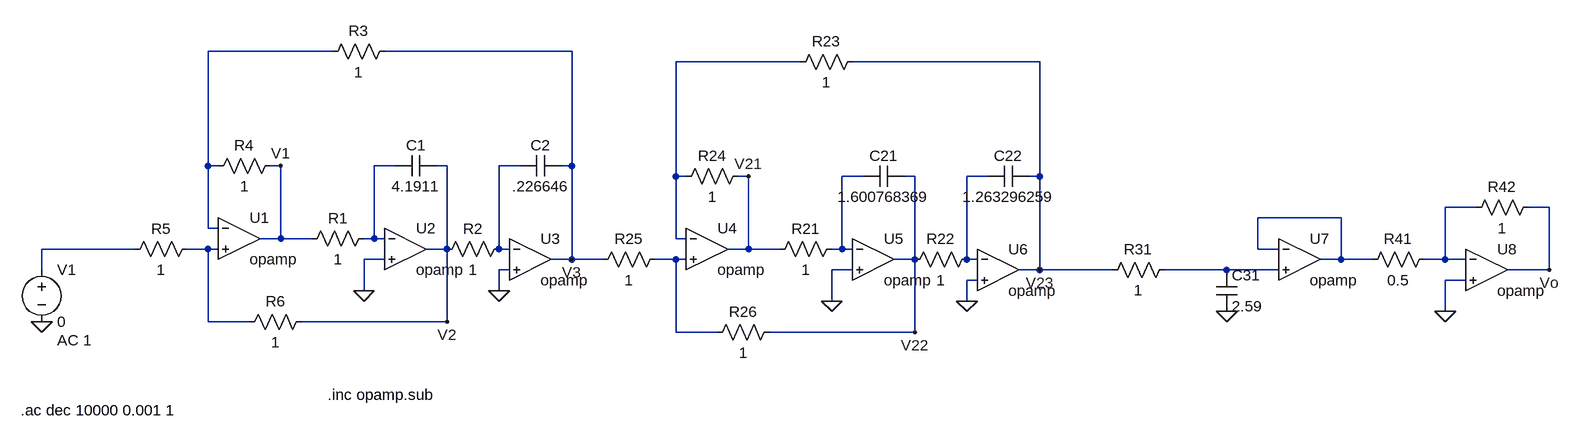
[diagram p0: schematic TS4.asc]
TS4.asc, the LTspice schematic file:
Version 4
SHEET 1 2228 680
WIRE 320 -144 128 -144
WIRE 688 -144 400 -144
WIRE 1040 -128 848 -128
WIRE 1408 -128 1120 -128
WIRE 128 32 128 -144
WIRE 144 32 128 32
WIRE 240 32 224 32
WIRE 416 32 384 32
WIRE 496 32 480 32
WIRE 608 32 576 32
WIRE 688 32 688 -144
WIRE 688 32 672 32
WIRE 848 48 848 -128
WIRE 864 48 848 48
WIRE 960 48 944 48
WIRE 1136 48 1104 48
WIRE 1216 48 1200 48
WIRE 1328 48 1296 48
WIRE 1408 48 1408 -128
WIRE 1408 48 1392 48
WIRE 2080 96 2032 96
WIRE 2192 96 2160 96
WIRE 1872 112 1744 112
WIRE 128 128 128 32
WIRE 144 128 128 128
WIRE 240 144 240 32
WIRE 240 144 208 144
WIRE 288 144 240 144
WIRE 384 144 384 32
WIRE 384 144 368 144
WIRE 400 144 384 144
WIRE 848 144 848 48
WIRE 864 144 848 144
WIRE 16 160 -128 160
WIRE 128 160 96 160
WIRE 144 160 128 160
WIRE 496 160 496 32
WIRE 496 160 464 160
WIRE 576 160 576 32
WIRE 592 160 576 160
WIRE 960 160 960 48
WIRE 960 160 928 160
WIRE 1008 160 960 160
WIRE 1104 160 1104 48
WIRE 1104 160 1088 160
WIRE 1120 160 1104 160
WIRE 1744 160 1744 112
WIRE 1776 160 1744 160
WIRE 400 176 368 176
WIRE 688 176 688 32
WIRE 688 176 656 176
WIRE 736 176 688 176
WIRE 848 176 816 176
WIRE 864 176 848 176
WIRE 1216 176 1216 48
WIRE 1216 176 1184 176
WIRE 1296 176 1296 48
WIRE 1312 176 1296 176
WIRE 1872 176 1872 112
WIRE 1872 176 1840 176
WIRE 1920 176 1872 176
WIRE 2032 176 2032 96
WIRE 2032 176 2000 176
WIRE 2064 176 2032 176
WIRE -128 192 -128 160
WIRE 592 192 576 192
WIRE 1120 192 1088 192
WIRE 1408 192 1408 48
WIRE 1408 192 1376 192
WIRE 1520 192 1408 192
WIRE 1696 192 1600 192
WIRE 1776 192 1696 192
WIRE 2192 192 2192 96
WIRE 2192 192 2128 192
WIRE 1312 208 1296 208
WIRE 2064 208 2032 208
WIRE 368 224 368 176
WIRE 576 224 576 192
WIRE 1088 240 1088 192
WIRE 1296 240 1296 208
WIRE 2032 256 2032 208
WIRE 128 272 128 160
WIRE 192 272 128 272
WIRE 496 272 496 160
WIRE 496 272 272 272
WIRE 848 288 848 176
WIRE 912 288 848 288
WIRE 1216 288 1216 176
WIRE 1216 288 992 288
FLAG 496 272 V2
FLAG 240 32 V1
FLAG 688 176 V3
FLAG 576 224 0
FLAG 368 224 0
FLAG -128 272 0
FLAG 1216 288 V22
FLAG 960 48 V21
FLAG 1408 192 V23
FLAG 1296 240 0
FLAG 1088 240 0
FLAG 1696 256 0
FLAG 2032 256 0
FLAG 2192 192 Vo
SYMBOL res 112 144 R90
WINDOW 0 0 56 VBottom 2
WINDOW 3 32 56 VTop 2
SYMATTR InstName R5
SYMATTR Value 1
SYMBOL Opamps\\opamp 176 80 R0
SYMATTR InstName U1
SYMBOL res 240 16 R90
WINDOW 0 0 56 VBottom 2
WINDOW 3 32 56 VTop 2
SYMATTR InstName R4
SYMATTR Value 1
SYMBOL res 288 256 R90
WINDOW 0 0 56 VBottom 2
WINDOW 3 32 56 VTop 2
SYMATTR InstName R6
SYMATTR Value 1
SYMBOL res 384 128 R90
WINDOW 0 0 56 VBottom 2
WINDOW 3 32 56 VTop 2
SYMATTR InstName R1
SYMATTR Value 1
SYMBOL Opamps\\opamp 432 96 R0
SYMATTR InstName U2
SYMBOL cap 480 16 R90
WINDOW 0 0 32 VBottom 2
WINDOW 3 32 32 VTop 2
SYMATTR InstName C1
SYMATTR Value 4.1911
SYMBOL Opamps\\opamp 624 112 R0
SYMATTR InstName U3
SYMBOL res 592 144 R90
WINDOW 0 0 56 VBottom 2
WINDOW 3 32 56 VTop 2
SYMATTR InstName R2
SYMATTR Value 1
SYMBOL cap 672 16 R90
WINDOW 0 0 32 VBottom 2
WINDOW 3 32 32 VTop 2
SYMATTR InstName C2
SYMATTR Value .226646
SYMBOL voltage -128 176 R0
WINDOW 123 24 124 Left 2
WINDOW 39 0 0 Left 2
SYMATTR Value2 AC 1
SYMATTR InstName V1
SYMATTR Value 0
SYMBOL res 416 -160 R90
WINDOW 0 0 56 VBottom 2
WINDOW 3 32 56 VTop 2
SYMATTR InstName R3
SYMATTR Value 1
SYMBOL res 832 160 R90
WINDOW 0 0 56 VBottom 2
WINDOW 3 32 56 VTop 2
SYMATTR InstName R25
SYMATTR Value 1
SYMBOL Opamps\\opamp 896 96 R0
SYMATTR InstName U4
SYMBOL res 960 32 R90
WINDOW 0 0 56 VBottom 2
WINDOW 3 32 56 VTop 2
SYMATTR InstName R24
SYMATTR Value 1
SYMBOL res 1008 272 R90
WINDOW 0 0 56 VBottom 2
WINDOW 3 32 56 VTop 2
SYMATTR InstName R26
SYMATTR Value 1
SYMBOL res 1104 144 R90
WINDOW 0 0 56 VBottom 2
WINDOW 3 32 56 VTop 2
SYMATTR InstName R21
SYMATTR Value 1
SYMBOL Opamps\\opamp 1152 112 R0
SYMATTR InstName U5
SYMBOL cap 1200 32 R90
WINDOW 0 0 32 VBottom 2
WINDOW 3 32 32 VTop 2
SYMATTR InstName C21
SYMATTR Value 1.600768369
SYMBOL Opamps\\opamp 1344 128 R0
SYMATTR InstName U6
SYMBOL res 1312 160 R90
WINDOW 0 0 56 VBottom 2
WINDOW 3 32 56 VTop 2
SYMATTR InstName R22
SYMATTR Value 1
SYMBOL cap 1392 32 R90
WINDOW 0 0 32 VBottom 2
WINDOW 3 32 32 VTop 2
SYMATTR InstName C22
SYMATTR Value 1.263296259
SYMBOL res 1136 -144 R90
WINDOW 0 0 56 VBottom 2
WINDOW 3 32 56 VTop 2
SYMATTR InstName R23
SYMATTR Value 1
SYMBOL res 1616 176 R90
WINDOW 0 0 56 VBottom 2
WINDOW 3 32 56 VTop 2
SYMATTR InstName R31
SYMATTR Value 1
SYMBOL cap 1680 192 R0
SYMATTR InstName C31
SYMATTR Value 2.59
SYMBOL Opamps\\opamp 1808 112 R0
SYMATTR InstName U7
SYMBOL Opamps\\opamp 2096 128 R0
SYMATTR InstName U8
SYMBOL res 2016 160 R90
WINDOW 0 0 56 VBottom 2
WINDOW 3 32 56 VTop 2
SYMATTR InstName R41
SYMATTR Value 0.5
SYMBOL res 2176 80 R90
WINDOW 0 0 56 VBottom 2
WINDOW 3 32 56 VTop 2
SYMATTR InstName R42
SYMATTR Value 1
TEXT 312 384 Left 2 !.inc opamp.sub
TEXT -160 408 Left 2 !.ac dec 10000 0.001 1

The netlist it stands for:
* TS4.asc
R5 N010 N009 1
XU1 N001 N010 V1 opamp Aol=100K GBW=10Meg  ; pins invin noninvin out
R4 V1 N001 1
R6 V2 N010 1
R1 N003 V1 1
XU2 N003 0 V2 opamp Aol=100K GBW=10Meg  ; pins invin noninvin out
C1 V2 N003 4.1911
XU3 N004 0 V3 opamp Aol=100K GBW=10Meg  ; pins invin noninvin out
R2 N004 V2 1
C2 V3 N004 .226646
V1 N009 0 0 AC 1
R3 V3 N001 1
R25 N011 V3 1
XU4 N002 N011 V21 opamp Aol=100K GBW=10Meg  ; pins invin noninvin out
R24 V21 N002 1
R26 V22 N011 1
R21 N005 V21 1
XU5 N005 0 V22 opamp Aol=100K GBW=10Meg  ; pins invin noninvin out
C21 V22 N005 1.600768369
XU6 N006 0 V23 opamp Aol=100K GBW=10Meg  ; pins invin noninvin out
R22 N006 V22 1
C22 V23 N006 1.263296259
R23 V23 N002 1
R31 N012 V23 1
C31 N012 0 2.59
XU7 N008 N012 N008 opamp Aol=100K GBW=10Meg  ; pins invin noninvin out
XU8 N007 0 Vo opamp Aol=100K GBW=10Meg  ; pins invin noninvin out
R41 N007 N008 0.5
R42 Vo N007 1
.inc opamp.sub
.ac dec 10000 0.001 1
.backanno
.end